# Altium schematic sheet expansions.SchDoc
size A4
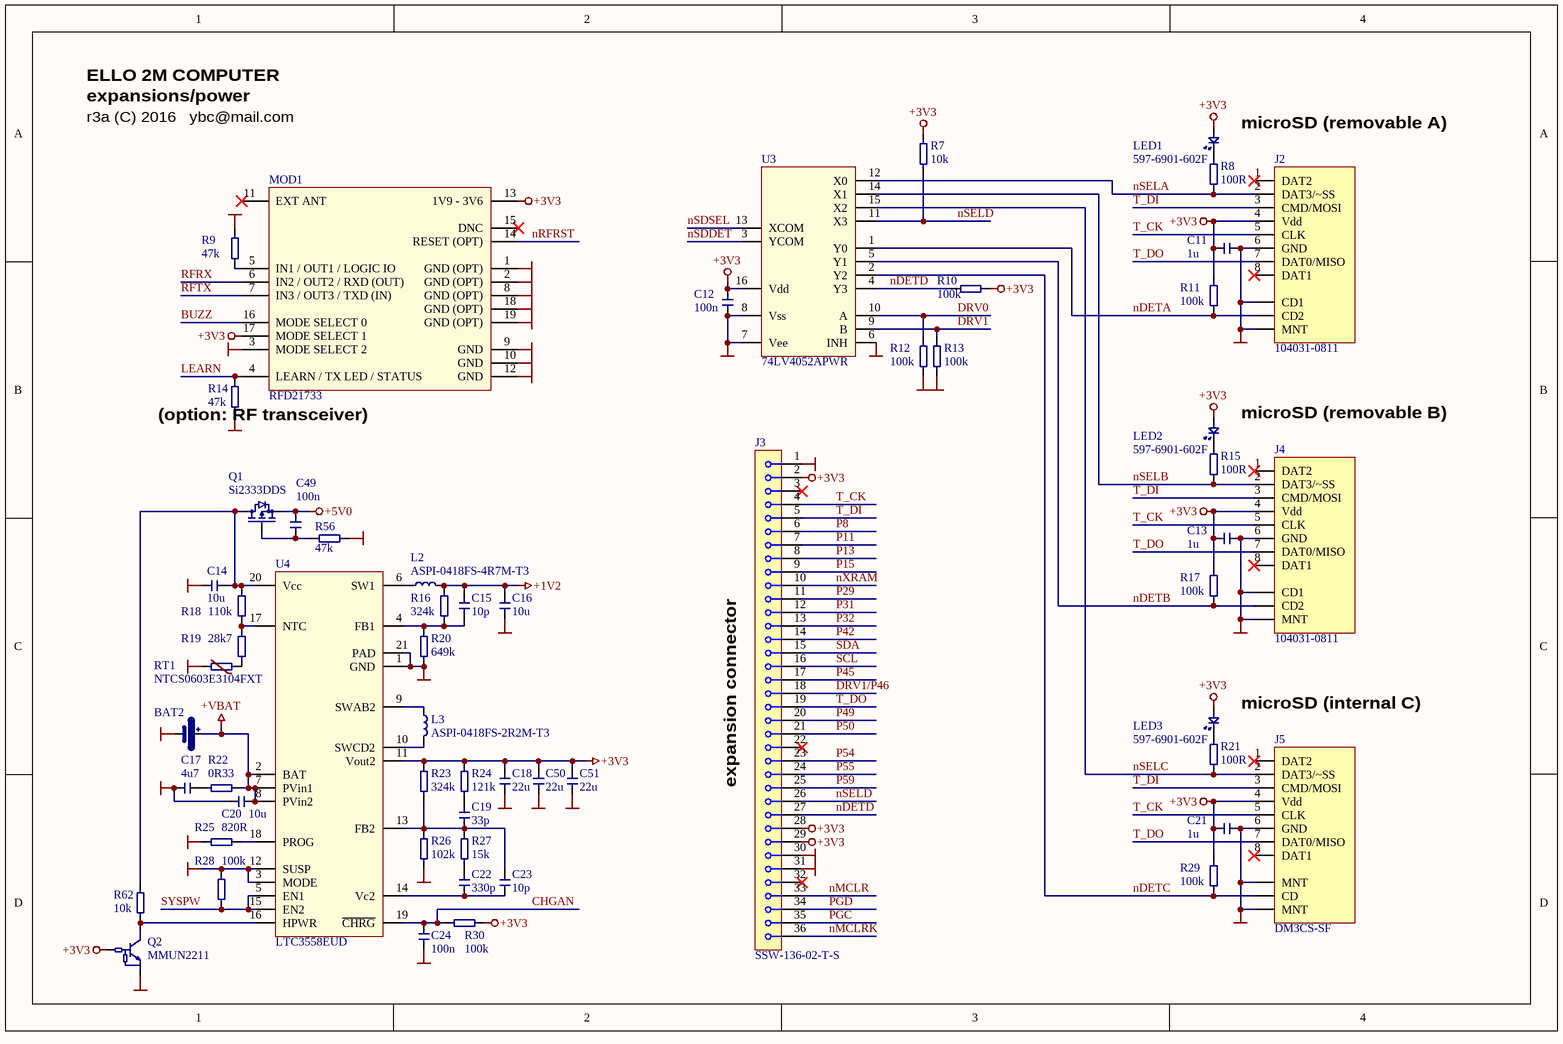
[diagram p0: expansions.SchDoc]

## Parts
BAT2  Battery  [Bat_Holder1]  (value not drawn)
C11  1u  [_0603]
C12  100n  [_0603]
C13  1u  [_0603]
C14  10u  [_1206]
C15  10p  [_0603]
C16  10u  [_1206]
C17  4u7  [_1206]
C18  22u  [_1206]
C19  33p  [_0603]
C20  10u  [_1206]
C21  1u  [_0603]
C22  330p  [_0603]
C23  10p  [_0603]
C24  100n  [_0603]
C49  100n  [_0603]
C50  22u  [_1206]
C51  22u  [_1206]
J2  104031-0811  [MOLEX_104031]
J3  SSW-136-02-T-S  [SSW-136-02-T-S]
J4  104031-0811  [MOLEX_104031]
J5  DM3CS-SF  [DM3CS-SF]
L2  ASPI-0418FS-4R7M-T3  [IND_4x4]
L3  ASPI-0418FS-2R2M-T3  [IND_4x4]
LED1  597-6901-602F  [LED1206 BOTTOM ENTRY]
LED2  597-6901-602F  [LED1206 BOTTOM ENTRY]
LED3  597-6901-602F  [LED1206 BOTTOM ENTRY]
MOD1  RFD21733  [RFDP8]
Q1  Si2333DDS  [SOT23-3]
Q2  MMUN2211  [SOT23-3]
R7  10k  [_0603]
R8  100R  [_0603]
R9  47k  [_0603]
R10  100k  [_0603]
R11  100k  [_0603]
R12  100k  [_0603]
R13  100k  [_0603]
R14  47k  [_0603]
R15  100R  [_0603]
R16  324k  [_0603]
R17  100k  [_0603]
R18  110k  [_0603]
R19  28k7  [_0603]
R20  649k  [_0603]
R21  100R  [_0603]
R22  0R33  [_1206]
R23  324k  [_0603]
R24  121k  [_0603]
R25  820R  [_0603]
R26  102k  [_0603]
R27  15k  [_0603]
R28  100k  [_0603]
R29  100k  [_0603]
R30  100k  [_0603]
R56  47k  [_0603]
R62  10k  [_0603]
RT1  NTCS0603E3104FXT  [_0603]
U3  74LV4052APWR  [SOP65P640X120-16N]
U4  LTC3558EUD  [QFN40P300X300X70_HS-21N]

## Nets
+1V2: C15.2 C16.2 L2.1 R16.1
+3V3: C11.1 C12.2 C13.1 C18.2 C21.1 C50.2 C51.2 J2.4(Vdd) J3.2 J3.28 J3.29 J4.4(Vdd) J5.4(Vdd) LED1.2 LED2.2 LED3.2 MOD1.13(1V9_-_3V6) MOD1.17(MODE_SELECT_1) Q2.1(B) R7.2 R10.2 R11.1 R17.1 R23.1 R24.1 R29.1 R30.2 U3.16(Vdd) U4.11(Vout2)
+5V0: C49.2 Q1.2(S)
+VBAT: BAT2.1 C20.2 R22.2 U4.2(BAT) U4.7(PVin1) U4.8(PVin2)
GND: BAT2.2 C11.2 C12.1 C13.2 C14.2 C16.1 C17.1 C18.1 C20.1 C21.2 C24.2 C50.1 C51.1 J2.6(GND) J2.CD1 J2.MNT J3.1 J3.30 J3.31 J4.6(GND) J4.CD1 J4.MNT J5.0(MNT) J5.6(GND) MOD1.1(GND_(OPT)) MOD1.2(GND_(OPT)) MOD1.3(MODE_SELECT_2) MOD1.8(GND_(OPT)) MOD1.9(GND) MOD1.10(GND) MOD1.12(GND) MOD1.18(GND_(OPT)) MOD1.19(GND_(OPT)) Q2.2(E) R9.2 R12.1 R13.1 R14.1 R20.2 R25.1 R26.2 R28.1 R56.2 RT1.2 U3.6(INH) U3.7(Vee) U3.8(Vss) U4.1(GND) U4.3(MODE) U4.12(SUSP) U4.21(PAD)
BUZZ: MOD1.16(MODE_SELECT_0)
CHGAN: C24.1 R30.1 U4.19(~{CHRG})
DRV0: R12.2 U3.10(A)
DRV1: R13.2 U3.9(B)
DRV1/P46: J3.18
LEARN: MOD1.4(LEARN_/_TX_LED_/_STATUS) R14.2
nDETA: J2.CD2 R11.2 U3.1(Y0)
nDETB: J4.CD2 R17.2 U3.5(Y1)
nDETC: J5.CD R29.2 U3.2(Y2)
nDETD: J3.27 R10.1 U3.4(Y3)
nMCLR: J3.33
nMCLRK: J3.36
nRFRST: MOD1.14(RESET_(OPT))
nSDDET: U3.3(YCOM)
nSDSEL: U3.13(XCOM)
nSELA: J2.2(DAT3/~SS) R8.2 U3.12(X0)
nSELB: J4.2(DAT3/~SS) R15.2 U3.14(X1)
nSELC: J5.2(DAT3/~SS) R21.2 U3.15(X2)
nSELD: J3.26 R7.1 U3.11(X3)
nXRAM: J3.10
P8: J3.6
P11: J3.7
P13: J3.8
P15: J3.9
P29: J3.11
P31: J3.12
P32: J3.13
P42: J3.14
P45: J3.17
P49: J3.20
P50: J3.21
P54: J3.23
P55: J3.24
P59: J3.25
PGC: J3.35
PGD: J3.34
RFRX: MOD1.6(IN2_/_OUT2_/_RXD_(OUT))
RFTX: MOD1.7(IN3_/_OUT3_/_TXD_(IN))
SCL: J3.16
SDA: J3.15
SYSPW: R28.2 U4.5(EN1) U4.15(EN2)
T_CK: J2.5(CLK) J3.4 J4.5(CLK) J5.5(CLK)
T_DI: J2.3(CMD/MOSI) J3.5 J4.3(CMD/MOSI) J5.3(CMD/MOSI)
T_DO: J2.7(DAT0/MISO) J3.19 J4.7(DAT0/MISO) J5.7(DAT0/MISO)
NetC14_1: C14.1 Q1.3(D) R18.1 R62.1 U4.20(Vcc)
NetC15_1: C15.1 R16.2 R20.1 U4.4(FB1)
NetC17_2: C17.2 R22.1
NetC19_1: C19.1 C23.2 R23.2 R26.1 R27.1 U4.13(FB2)
NetC19_2: C19.2 R24.2
NetC22_1: C22.1 C23.1 U4.14(Vc2)
NetC22_2: C22.2 R27.2
NetC49_1: C49.1 Q1.1(G) R56.1
NetL2_2: L2.2 U4.6(SW1)
NetL3_1: L3.1 U4.10(SWCD2)
NetL3_2: L3.2 U4.9(SWAB2)
NetLED1_1: LED1.1 R8.1
NetLED2_1: LED2.1 R15.1
NetLED3_1: LED3.1 R21.1
NetMOD1_5: MOD1.5(IN1_/_OUT1_/_LOGIC_IO) R9.1
NetQ2_3: Q2.3(C) R62.2 U4.16(HPWR)
NetR18_2: R18.2 R19.1 U4.17(NTC)
NetR19_2: R19.2 RT1.1
NetR25_2: R25.2 U4.18(PROG)

Not connected (* = marked no-connect by the designer): J2 1(DAT2)* 8(DAT1)*; J3 3* 22* 32*; J4 1(DAT2)* 8(DAT1)*; J5 1(DAT2)* 8(DAT1)*; MOD1 11(EXT_ANT)* 15(DNC)*

## Notes on the sheet
- ELLO 2M COMPUTER
- expansions/power
- r3a (C) 2016   ybc@mail.com
- microSD (removable A)
- (near MOD1) (option: RF transceiver)
- microSD (removable B)
- microSD (internal C)
- (near J3) expansion connector

## Library data of the parts
C11-C24 C49-C51 = Capacitor
J2 J4 J5 = microSD (w/ card detect): microSD card connector
J3 = Connector 1x36: Single row, 36-way connector
L2 L3 = Inductor
LED1-LED3 = LED: Light Emitting Diode
MOD1 = RFDP8: Complete 2.4GHz RF transceiver module with built-in RFDP8 application protocol; Manufacturer: RF Digital; Defined by: Dimitech Ltd; Series: RFD2173x; Similar: *; URL: www.rfdigital.com
Q1 = P-FET: P-channel FET transistor
Q2 = NPN BIASED: NPN biased bipolar transistor
R7-R30 R56 R62 = Resistor
RT1 = Thermistor
U3 = 4052: Quad CMOS Analog Multiplexers/Demultiplexers with Logic Level Conversion
U4 = LTC3558: Linear USB Battery Charger with Buck and Buck-Boost Regulators; Manufacturer: Linear